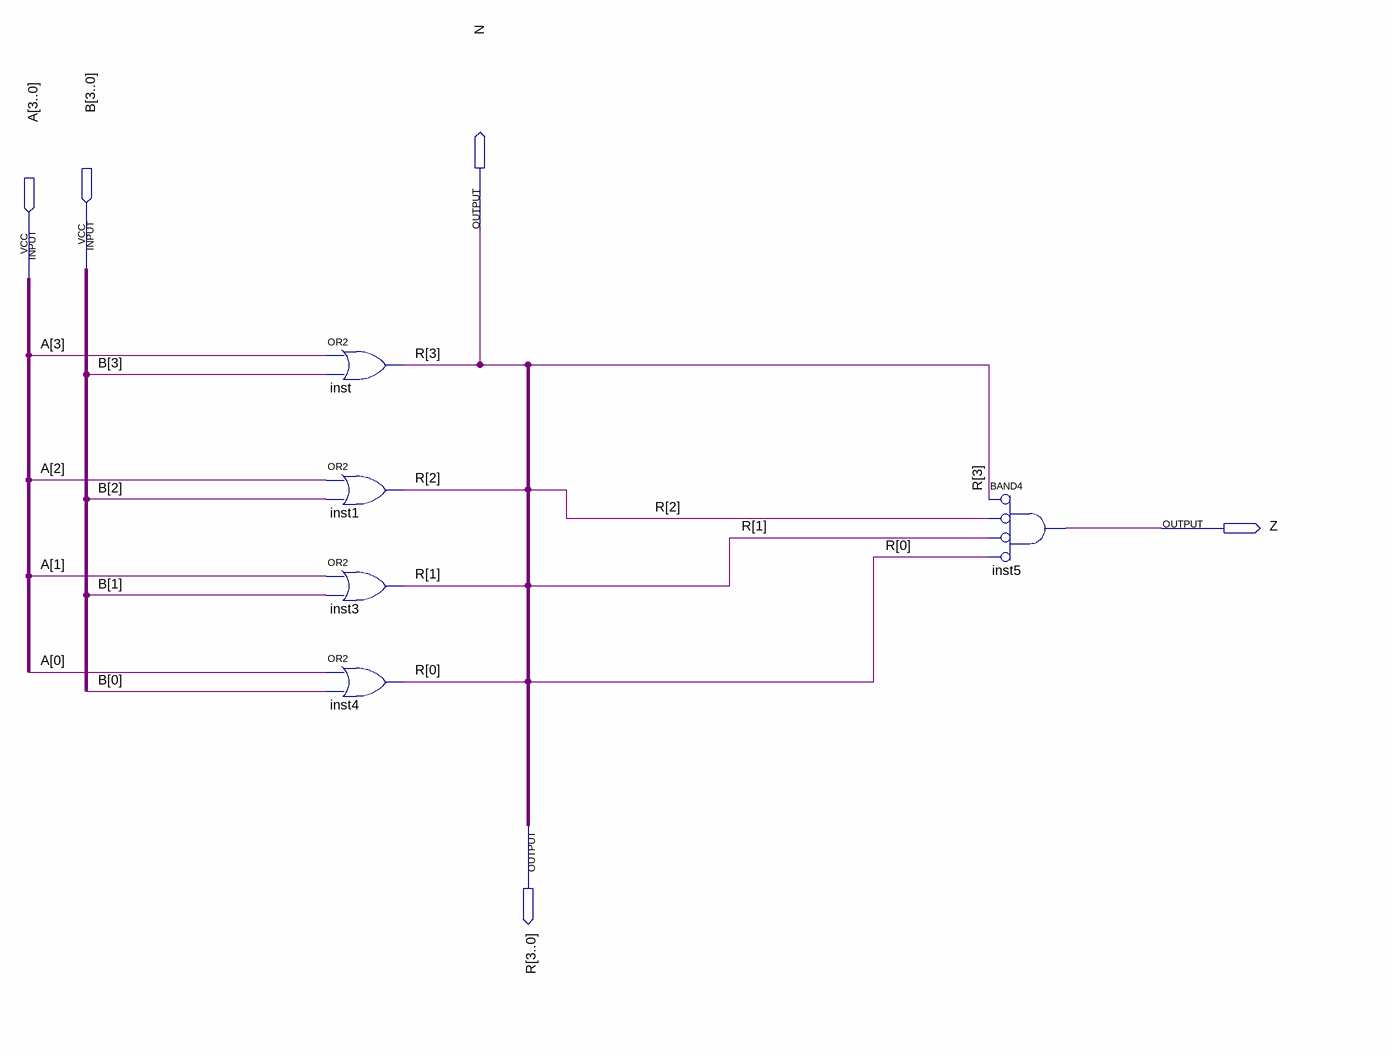
[diagram p0: schematic sheet]
// Quartus schematic BloqueOR.bdf as structural Verilog: 5 symbols, 5 pins
module BloqueOR (
  input  [3:0] B,
  input  [3:0] A,
  output N,
  output Z,
  output [3:0] R
);

  or inst (N, A[3], B[3]);
  or inst1 (R[2], A[2], B[2]);
  or inst3 (R[1], A[1], B[1]);
  or inst4 (R[0], A[0], B[0]);
  and inst5 (Z, ~N, ~R[2], ~R[1], ~R[0]);  // BAND4

  assign R[3] = N;
endmodule
